# EAGLE schematic watersensor (EAGLE 9.5.1)
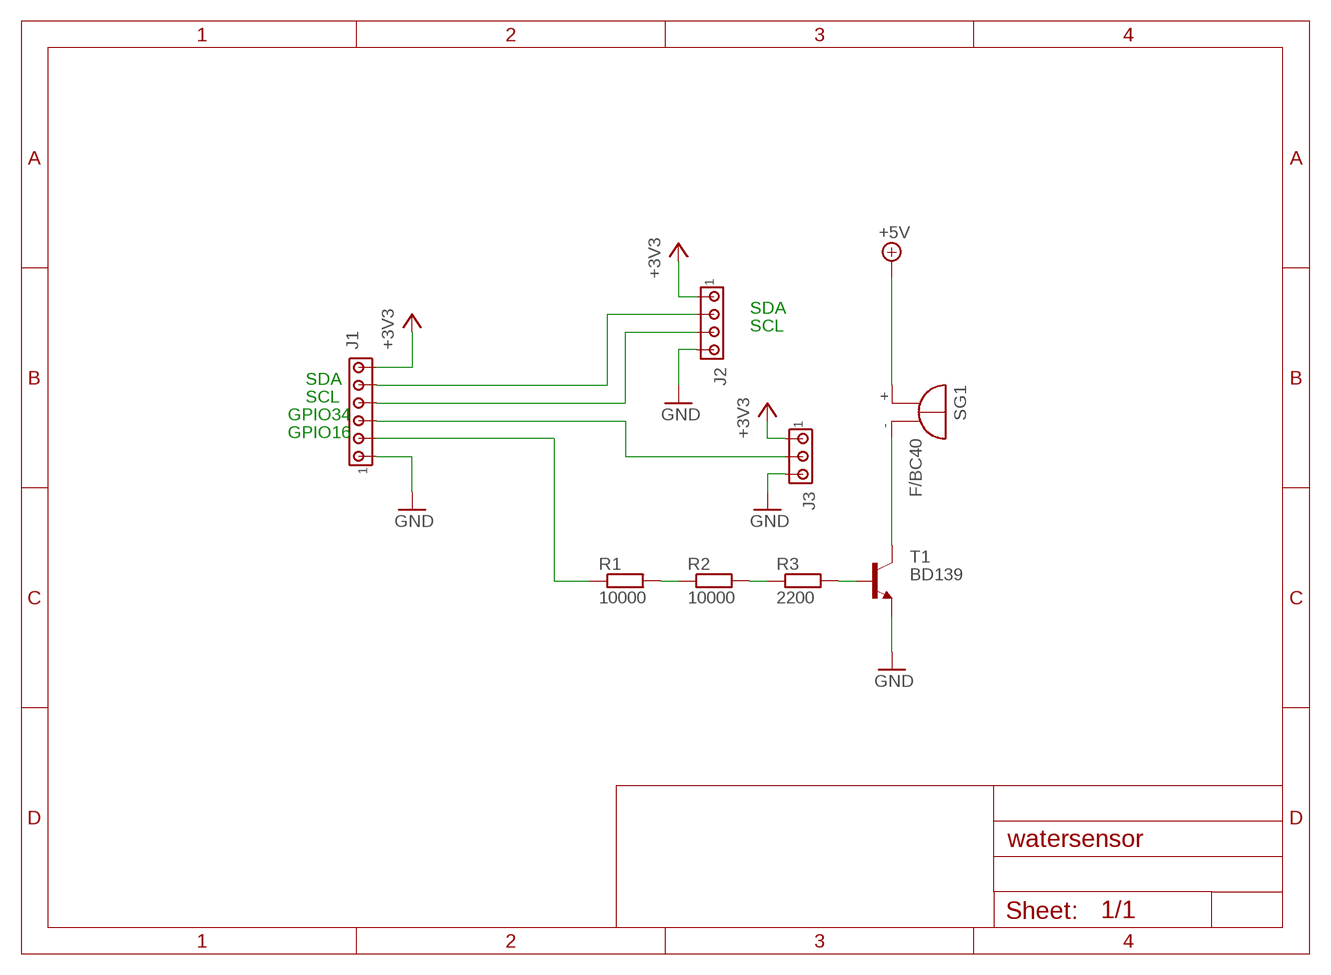
[diagram p0: schematic, sheet 1]

## Parts
J1  MTA06-100  [10X06MTA]
J2  MTA04-100  [10X04MTA]
J3  MTA03-100  [10X03MTA]
R1  10000  R-EU_0204/7  [0204/7]
R2  10000  R-EU_0204/7  [0204/7]
R3  2200  R-EU_0204/7  [0204/7]
SG1  F/BC40  [F/BC40]
T1  BD139  [TO126]

## Nets
+3V3: J1.6 J2.1 J3.1
+5V: SG1.+
GND: J1.1 J2.4 J3.3 T1.1(E)
N$1: J1.2 R1.1
N$2: J1.5 J2.2
N$3: J1.4 J2.3
N$4: SG1.- T1.2(C)
N$5: J1.3 J3.2
N$8: R1.2 R2.1
N$9: R2.2 R3.1
N$10: R3.2 T1.3(B)

## Notes on the sheet
- SDA
- SCL
- SDA
- SCL
- GPIO34
- GPIO16

## Library data of the parts
J1 = con-amp:MTA06-100: AMP connector Connection corrected 2014-09-19
J2 = con-amp:MTA04-100: AMP connector
J3 = con-amp:MTA03-100: AMP connector
R1-R3 = rcl:R-EU_: RESISTOR, European symbol; SPICEPREFIX: R
SG1 = buzzer:F/BC40: BUZZER Source: Spoerle; OC_FARNELL: unknown; OC_NEWARK: unknown
T1 = transistor:BD139: NPN TRANSISTOR